# Altium project zWatch.PrjPCB
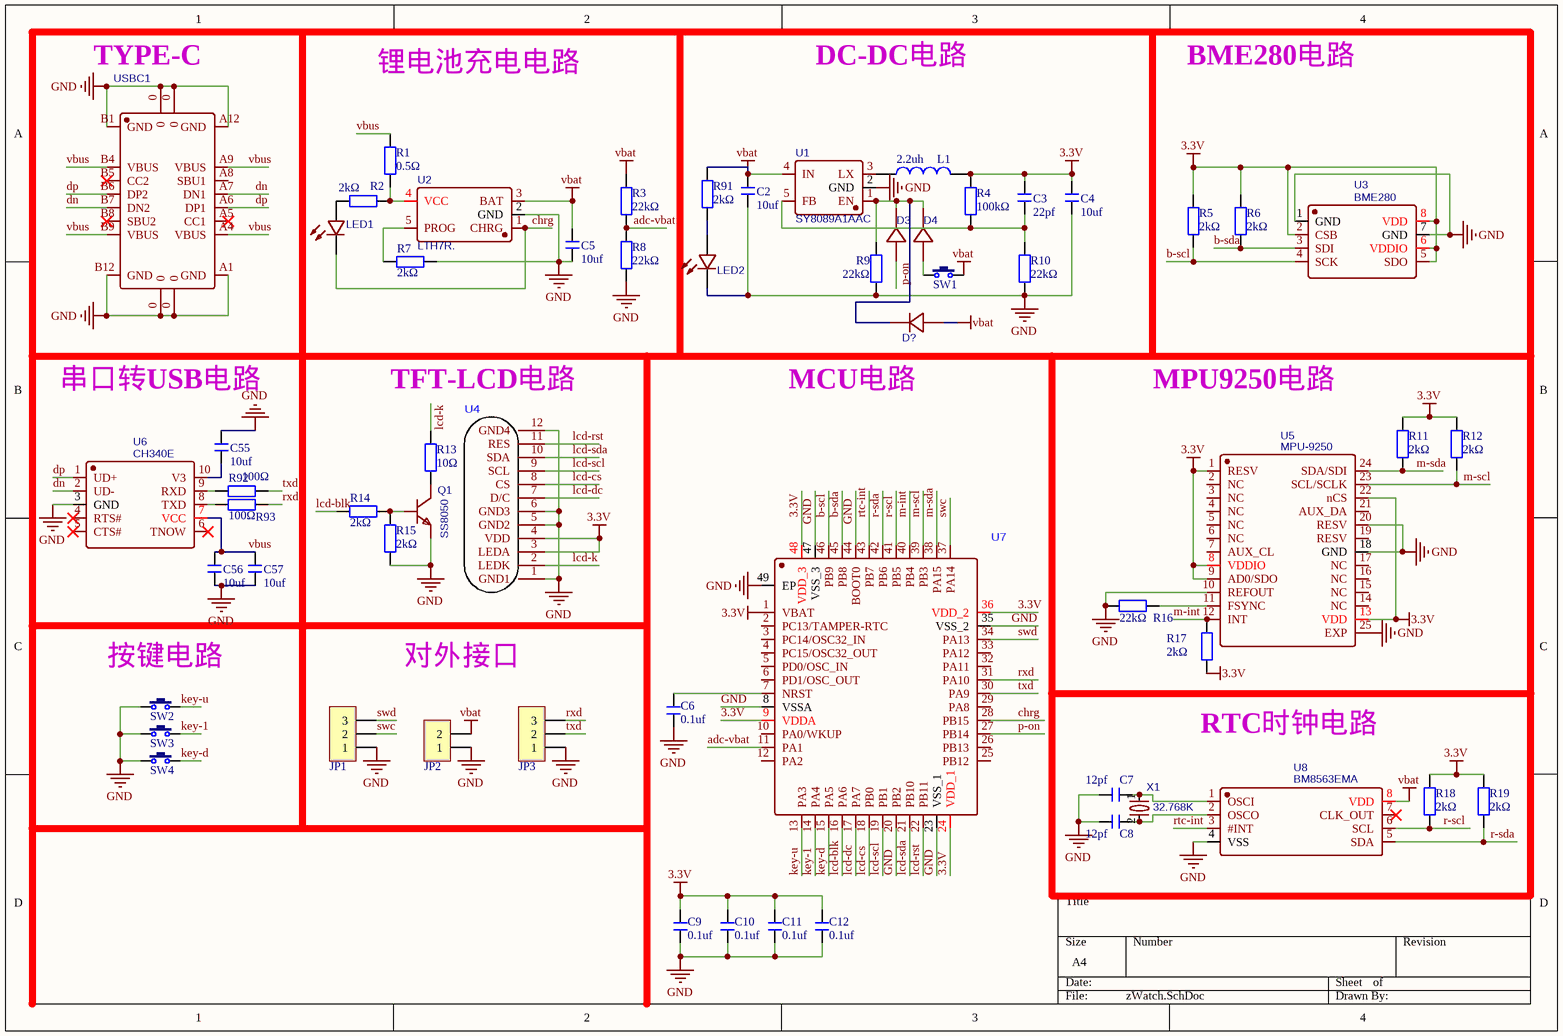
[diagram p0: zWatch.SchDoc]
1 sheet, 60 parts. Net scope: global (net labels, ports and power ports of the same name join across sheets).
Board file: zWatch.PcbDoc

## Sheet zWatch.SchDoc
size A4

### Parts
C2  10uf  [0402-c]
C3  22pf  [0402-c]
C4  10uf  [0402-c]
C5  10uf  [0402-c]
C6  0.1uf  [0402-c]
C7  12pf  [0402-c]
C8  12pf  [0402-c]
C9  0.1uf  [0402-c]
C10  0.1uf  [0402-c]
C11  0.1uf  [0402-c]
C12  0.1uf  [0402-c]
C55  10uf  [0402-c]
C56  10uf  [0402-c]
C57  10uf  [0402-c]
D3  1N4148  [SOD-123_L3.1-W1.7-LS3.7-RD]  (value not drawn)
D4  1N4148  [SOD-123_L3.1-W1.7-LS3.7-RD]  (value not drawn)
D?  1N4148  [SOD-123_L3.1-W1.7-LS3.7-RD]  (value not drawn)
JP1  HDR-1X3  [HDR-1X3]  (value not drawn)
JP2  HDR-1X2  [1.27-1X2]  (value not drawn)
JP3  HDR-1X3  [HDR-1X3]  (value not drawn)
L1  2.2uh  [0603-L]
LED1  绿色led  [LED0402-RD]  (value not drawn)
LED2  绿色led  [LED0402-RD]  (value not drawn)
Q1  SS8050  [SOT-23-3_L2.9-W1.3-P1.90-LS2.4-BR]
R1  0.5Ω  [0402-c]
R2  2kΩ  [0402-c]
R3  22kΩ  [0402-c]
R4  100kΩ  [0402-c]
R5  2kΩ  [0402-c]
R6  2kΩ  [0402-c]
R7  2kΩ  [0402-c]
R8  22kΩ  [0402-c]
R9  22kΩ  [0402-c]
R10  22kΩ  [0402-c]
R11  2kΩ  [0402-c]
R12  2kΩ  [0402-c]
R13  10Ω  [0402-c]
R14  2kΩ  [0402-c]
R15  2kΩ  [0402-c]
R16  22kΩ  [0402-c]
R17  2kΩ  [0402-c]
R18  2kΩ  [0402-c]
R19  2kΩ  [0402-c]
R91  2kΩ  [0402-c]
R92  100Ω  [0402-c]
R93  100Ω  [0402-c]
SW1  3x6x5  [SW-SMD_L4.7-W3.5-P3.35-EH]  (value not drawn)
SW2  3x6x5  [SW-SMD_L4.7-W3.5-P3.35-EH]  (value not drawn)
SW3  3x6x5  [SW-SMD_L4.7-W3.5-P3.35-EH]  (value not drawn)
SW4  3x6x5  [SW-SMD_L4.7-W3.5-P3.35-EH]  (value not drawn)
U1  SY8089A1AAC  [SOT-23-5_L3.0-W1.7-P0.95-LS2.8-BL]
U2  LTH7R.  [SOT-23-5_L3.0-W1.7-P0.95-LS2.8-BL]
U3  BME280  [LGA-8_BME280_BR]
U4  (no value)  [new,one]
U5  MPU-9250  [QFN-24_L3.0-W3.0-P0.40-BL-EP]
U6  CH340E  [MSOP-10_L3.0-W3.0-P0.50-LS5.0-BL]
U7  (no value)  [QFN-48_L6.0-W6.0-P0.40-BL-EP4.2]
U8  BM8563EMA  [MSOP-8_L3.0-W3.0-P0.65-LS5.0-BL]
USBC1  TYPE-C-31-M-12  [USB-C_SMD-TYPE-C-31-M-12]  (value not drawn)
X1  32.768K  [OSC-SMD_L3.2-W1.5]

### Nets
3.3V: C3.2 C4.2 C9.1 C10.1 C11.1 C12.1 L1.2 R4.2 R5.2 R6.2 R11.2 R12.2 R17.2 R18.2 R19.2 U3.2(CSB) U3.5(SDO) U3.6(VDDIO) U3.8(VDD) U4.3(LEDA) U4.4(VDD) U5.1(RESV) U5.8(VDDIO) U5.9(AD0/SDO) U5.13(VDD) U5.22(nCS) U7.1(VBAT) U7.9(VDDA) U7.24(VDD_1) U7.36(VDD_2) U7.48(VDD_3)
GND: C2.1 C4.1 C5.1 C6.2 C7.2 C8.2 C9.2 C10.2 C11.2 C12.2 C55.2 C56.1 C57.1 JP1.1 JP2.1 JP3.1 LED2.1(-) Q1.2(E) R7.1 R8.2 R9.1 R10.1 R15.2 R16.2 SW2.1 SW3.1 SW4.1 U1.2(GND) U2.2(GND) U3.1(GND) U3.7(GND) U4.1(GND1) U4.5(GND2) U4.6(GND3) U4.12(GND4) U5.10(REFOUT) U5.18(GND) U5.20(RESV) U5.25(EXP) U6.3(GND) U7.8(VSSA) U7.20(PB2) U7.23(VSS_1) U7.35(VSS_2) U7.44(BOOT0) U7.47(VSS_3) U7.49(EP) U8.4(VSS) USBC1.0 USBC1.A1(GND) USBC1.A12(GND) USBC1.B1(GND) USBC1.B12(GND)
vbat: C2.2 C5.2 D?.2(A) JP2.2 R3.1 R91.2 SW1.2 U1.4(IN) U2.3(BAT) U8.8(VDD)
adc-vbat: R3.2 R8.1 U7.11(PA1)
b-scl: R5.1 U3.4(SCK) U7.46(PB9)
b-sda: R6.1 U3.3(SDI) U7.45(PB8)
chrg: LED1.1(-) U2.1(CHRG) U7.28(PB15)
dn: U6.2(UD-) USBC1.A7(DN1) USBC1.B7(DN2)
dp: U6.1(UD+) USBC1.A6(DP1) USBC1.B6(DP2)
key-1: SW3.2 U7.14(PA4)
key-d: SW4.2 U7.15(PA5)
key-u: SW2.2 U7.13(PA3)
lcd-blk: R14.2 U7.16(PA6)
lcd-cs: U4.8(CS) U7.18(PB0)
lcd-dc: U4.7(D/C) U7.17(PA7)
lcd-k: R13.1 U4.2(LEDK)
lcd-rst: U4.11(RES) U7.22(PB11)
lcd-scl: U4.9(SCL) U7.19(PB1)
lcd-sda: U4.10(SDA) U7.21(PB10)
m-int: R17.1 U5.12(INT) U7.40(PB4)
m-scl: R12.1 U5.23(SCL/SCLK) U7.39(PB3)
m-sda: R11.1 U5.24(SDA/SDI) U7.38(PA15)
p-on: D3.2(A) U7.27(PB14)
r-scl: R18.1 U7.41(PB5) U8.6(SCL)
r-sda: R19.1 U7.42(PB6) U8.5(SDA)
rtc-int: U7.43(PB7) U8.3(#INT)
rxd: JP3.3 R93.2 U7.31(PA10)
swc: JP1.2 U7.37(PA14)
swd: JP1.3 U7.34(PA13)
txd: JP3.2 R92.2 U7.30(PA9)
vbus: C56.2 C57.2 R1.2 U6.7(VCC) USBC1.A4(VBUS) USBC1.A9(VBUS) USBC1.B4(VBUS) USBC1.B9(VBUS)
NetC3_1: C3.1 R4.1 R10.2 U1.5(FB)
NetC6_1: C6.1 U7.7(NRST)
NetC7_1: C7.1 U8.1(OSCI) X1.1
NetC8_1: C8.1 U8.2(OSCO) X1.2(GND)
NetC55_1: C55.1 U6.10(V3)
NetD3_1: D3.1(K) D4.1(K) D?.1(K) R9.2 U1.1(EN)
NetD4_2: D4.2(A) SW1.1
NetL1_1: L1.1 U1.3(LX)
NetLED1_2: LED1.2(+) R2.1
NetLED2_2: LED2.2(+) R91.1
NetQ1_1: Q1.1(B) R14.1 R15.1
NetQ1_3: Q1.3(C) R13.2
NetR1_1: R1.1 R2.2 U2.4(VCC)
NetR7_2: R7.2 U2.5(PROG)
NetR16_1: R16.1 U5.11(FSYNC)
NetR92_1: R92.1 U6.9(RXD)
NetR93_1: R93.1 U6.8(TXD)

Not connected (* = marked no-connect by the designer): U5 2(NC) 3(NC) 4(NC) 5(NC) 6(NC) 7(AUX_CL) 14(NC) 15(NC) 16(NC) 17(NC) 19(RESV) 21(AUX_DA); U6 4(RTS#)* 5(CTS#)* 6(TNOW)*; U7 2(PC13/TAMPER-RTC) 3(PC14/OSC32_IN) 4(PC15/OSC32_OUT) 5(PD0/OSC_IN) 6(PD1/OSC_OUT) 10(PA0/WKUP) 12(PA2) 25(PB12) 26(PB13) 29(PA8) 32(PA11) 33(PA12); U8 7(CLK_OUT)*; USBC1 A5(CC1)* A8(SBU1) B5(CC2)* B8(SBU2)*

### Notes on the sheet
- (near USBC1) TYPE-C
- 锂电池充电电路
- DC-DC电路
- BME280电路
- 串口转USB电路
- TFT-LCD电路
- MCU电路
- MPU9250电路
- (near SW2) 按键电路
- 对外接口
- RTC时钟电路

### Library data of the parts
C2-C12 C55-C57 = C: 无极性贴片电容; 版权归属: 源创客; BOM名称: 无极性贴片电容; 学习资源: www.ooocke.com
D3 D4 D? = 1N4148W_C727110: BOM_Manufacturer: TWGMC; Contributor: LCSC; BOM_Supplier: LCSC; BOM_Supplier Part: C727110; BOM_Manufacturer Part: 1N4148W; BOM_JLCPCB Part Class: Extended Part; spicePre: D; spiceSymbolName: 1N4148W_C727110
JP1 JP3 = Header 3: 3P接插件; 版权归属: 源创客; BOM名称: 3P接插件; 学习资源: www.ooocke.com
JP2 = Header 2: 2P接插件; 版权归属: 源创客; BOM名称: 2P接插件; 学习资源: www.ooocke.com
L1 = L: 小功率贴片电感; 版权归属: 源创客; BOM名称: 小功率贴片电感; 学习资源: www.ooocke.com
LED1 LED2 = 16-213/SDRC/S530-A3/TR8: BOM_Manufacturer: EVERLIGHT; BOM_Supplier: LCSC; BOM_Manufacturer Part: 16-213/SDRC/S530-A3/TR8; BOM_Supplier Part: C71911; BOM_JLCPCB Part Class: Extended Part; spicePre: L; spiceSymbolName: 16-213/SDRC/S530-A3/TR8
Q1 = SS8050: BOM_Manufacturer: WPMtek(维攀微); Contributor: LCSC; BOM_Supplier: LCSC; BOM_Supplier Part: C2688219; BOM_Manufacturer Part: SS8050; BOM_JLCPCB Part Class: Extended Part; spicePre: Q; spiceSymbolName: SS8050
R1-R19 R91-R93 = 0402 0Ω (0R0) 1%: 贴片电阻; ComponentLink1Description: 供应商链接; ComponentLink1URL: http://www.szlcsc.com/product/details_17853.html; Package: 0402; Supplier: LC; SuppliersPartNumber: C17168
SW1-SW4 = TSW 3x6: 3x6轻触开关; 版权归属: 源创客; BOM名称: 3x6轻触开关; 学习资源: www.ooocke.com
U1 = SY8089A1AAC: BOM_Manufacturer: Silergy Corp; Contributor: LCSC; BOM_Supplier: LCSC; BOM_Supplier Part: C479074; BOM_Manufacturer Part: SY8089A1AAC; BOM_JLCPCB Part Class: Extended Part; spicePre: U; spiceSymbolName: SY8089A1AAC
U2 = LTH7R.: BOM_Manufacturer: Shenzhen Fuman Elec; Contributor: LCSC; BOM_Paste Type: Extended Part; BOM_Supplier: LCSC; BOM_Supplier Part: C841234; BOM_Manufacturer Part: LTH7R.; JLCPCB Part Class: Extended Part; spicePre: U; spiceSymbolName: LTH7R.
U3 = BME280: BOM_Manufacturer: Bosch; Contributor: LCSC; BOM_Supplier: LCSC; BOM_Manufacturer Part: BME280; BOM_Supplier Part: C92489; BOM_JLCPCB Part Class: Extended Part; spicePre: U; spiceSymbolName: BME280
U4 = ZJY128R-IG01
U5 = MPU-9250: BOM_Manufacturer: InvenSense; Contributor: LCSC; BOM_Supplier: LCSC; BOM_Manufacturer Part: MPU-9250; BOM_Supplier Part: C71459; BOM_JLCPCB Part Class: Extended Part; spicePre: U; spiceSymbolName: MPU-9250
U6 = CH340E: BOM_Manufacturer: WCH; BOM_Supplier: LCSC; BOM_Manufacturer Part: CH340E; BOM_Supplier Part: C99652; BOM_JLCPCB Part Class: Extended Part; spicePre: U; spiceSymbolName: CH340E
U7 = AT32F403ACGU7
U8 = BM8563EMA: BOM_Manufacturer: GATEMODE; Contributor: LCSC; BOM_Supplier: LCSC; BOM_Supplier Part: C269878; BOM_Manufacturer Part: BM8563EMA; BOM_JLCPCB Part Class: Extended Part; spicePre: U; spiceSymbolName: BM8563EMA
USBC1 = TYPE-C-31-M-12: BOM_Manufacturer: Rectangular Connectors - Contacts; Contributor: LCSC; BOM_Supplier: LCSC; BOM_Supplier Part: C165948; BOM_Manufacturer Part: TYPE-C-31-M-12; BOM_JLCPCB Part Class: Extended Part; spicePre: U; spiceSymbolName: TYPE-C-31-M-12
X1 = TFX-02S-32.768KJ21058: BOM_Manufacturer: RIVER(大河); Contributor: LCSC; BOM_Supplier: LCSC; BOM_Supplier Part: C2693417; BOM_Manufacturer Part: TFX-02S-32.768KJ21058; spicePre: X; spiceSymbolName: TFX-02S-32.768KJ21058